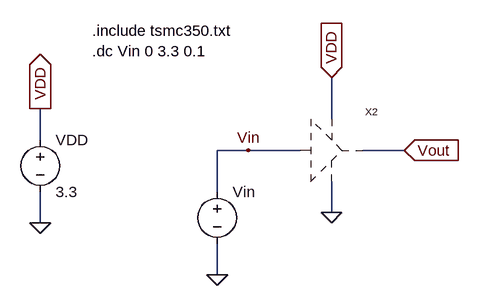
[diagram p0: schematic lab5task4.asc]
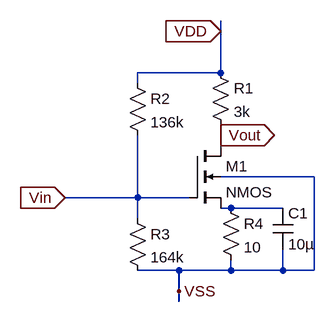
[diagram p1: sub-circuit vdamplifier.asc]
lab5task4.asc, the LTspice schematic file:
Version 4
SHEET 1 880 680
WIRE 560 304 560 240
WIRE 112 336 112 288
WIRE 432 352 384 352
WIRE 512 352 432 352
WIRE 672 352 608 352
WIRE 384 416 384 352
WIRE 560 448 560 400
WIRE 112 464 112 416
WIRE 384 544 384 496
FLAG 112 464 0
FLAG 112 288 VDD
IOPIN 112 288 Out
FLAG 384 544 0
FLAG 560 240 VDD
IOPIN 560 240 In
FLAG 432 352 Vin
FLAG 672 352 Vout
IOPIN 672 352 In
FLAG 560 448 0
SYMBOL Voltage 112 320 R0
SYMATTR InstName VDD
SYMATTR Value 3.3
SYMBOL Voltage 384 400 R0
SYMATTR InstName Vin
SYMATTR Value ""
SYMBOL VDAmplifier 576 352 R0
SYMATTR InstName X2
TEXT 192 168 Left 2 !.include tsmc350.txt\n.dc Vin 0 3.3 0.1

vdamplifier.asc, the sub-circuit schematic file:
Version 4
SHEET 1 880 680
WIRE 352 112 352 96
WIRE 352 176 352 112
WIRE 352 176 224 176
WIRE 224 192 224 176
WIRE 352 272 352 256
WIRE 352 288 352 272
WIRE 496 336 352 336
WIRE 224 368 224 272
WIRE 224 368 112 368
WIRE 304 368 224 368
WIRE 368 384 352 384
WIRE 448 384 368 384
WIRE 224 400 224 368
WIRE 288 480 224 480
WIRE 368 480 368 464
WIRE 368 480 288 480
WIRE 448 480 448 448
WIRE 448 480 368 480
WIRE 496 480 496 336
WIRE 496 480 448 480
WIRE 288 512 288 480
WIRE 288 528 288 512
FLAG 352 112 VDD
IOPIN 352 112 In
FLAG 112 368 Vin
IOPIN 112 368 In
FLAG 288 512 VSS
FLAG 352 272 Vout
IOPIN 352 272 Out
SYMBOL res 336 160 R0
SYMATTR InstName R1
SYMATTR Value 3k
SYMBOL nmos4 304 288 R0
SYMATTR InstName M1
SYMATTR Value2 l=350n w=3500n
SYMBOL Res 208 176 R0
SYMATTR InstName R2
SYMATTR Value 136k
SYMBOL Res 208 384 R0
SYMATTR InstName R3
SYMATTR Value 164k
SYMBOL Res 352 368 R0
SYMATTR InstName R4
SYMATTR Value 10
SYMBOL Cap 432 384 R0
SYMATTR InstName C1
SYMATTR Value 10µ

The netlist it stands for:
* lab5task4.asc
VDD VDD 0 3.3
Vin Vin 0
XX2 Vin VDD 0 Vout vdamplifier

* block symbol definitions
.subckt vdamplifier Vin VDD VSS Vout
R1 VDD Vout 3k
M1 Vout Vin N001 VSS NMOS l=350n w=3500n
R2 VDD Vin 136k
R3 Vin VSS 164k
R4 N001 VSS 10
C1 N001 VSS 10µ
.ends vdamplifier

.model NMOS NMOS
.model PMOS PMOS
.lib standard.mos
.include tsmc350.txt
.dc Vin 0 3.3 0.1
.backanno
.end